# EAGLE design breakout (EAGLE 6.2)
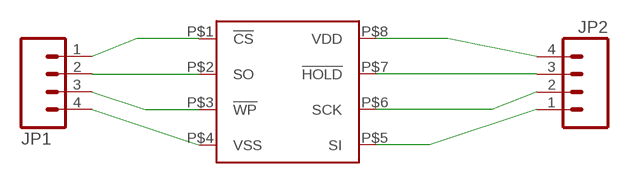
[diagram p0: schematic, sheet 1]

## Parts
JP1  M04PTH  [1X04]
JP2  M04PTH  [1X04]
U$1  MR25H256  [DFN8]

## Nets
N$1: JP1.1 U$1.P$1(!CS)
N$2: JP1.2 U$1.P$2(SO)
N$3: JP1.3 U$1.P$3(!WP)
N$4: JP1.4 U$1.P$4(VSS)
N$5: JP2.1 U$1.P$5(SI)
N$6: JP2.2 U$1.P$6(SCK)
N$7: JP2.3 U$1.P$7(!HOLD)
N$8: JP2.4 U$1.P$8(VDD)

## Library data of the parts
JP1 JP2 = SparkFun-Connectors:M04: Header 4 Standard 4-pin 0.1" header. Use with straight break away headers (SKU : PRT-00116), right angle break away headers (PRT-00553), swiss pins (PRT-00743), machine pins (PRT-00117), and female headers (PRT-00115). Molex polarized connector foot print use with SKU : PRT-08231 with associated crimp pins and housings. 1MM SMD Version SKU: PRT-10208
U$1 = jv2:MR25H256

## Board
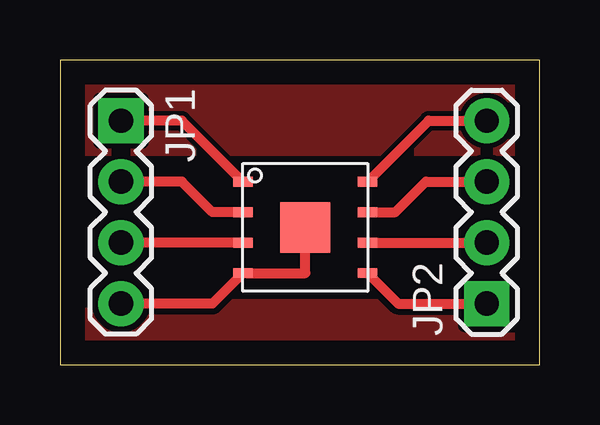
[diagram p1: board, top side]

Size 19.99 x 12.69 mm. Coordinates in mm from the lower left corner, seen from the top.
Outline: 0,0 19.99,0 19.99,12.69 0,12.69 0,0
Copper layers (1*16): Top 0.035mm / dielectric 1.5mm / Bottom 0.035mm
Design rules: minimum track width 10mil, minimum drill 24mil, track to track 8mil, track to pad 8mil, pad to pad 8mil, via to via 8mil, smd to smd 8mil, copper to edge 40mil, drill to drill 8mil, minimum pad ring 10mil, minimum via ring 8mil, stop-mask expansion 4mil, vias tented up to drill 0mil, thermal gap 10mil

### Footprints (pad centres in the part's own frame; a part is rotated, then mirrored left to right if it is on the bottom)
1X04 = drill 1.016 pad 1.88 square: 1 0,0 | drill 1.016 pad 1.88: 2 2.54,0; 3 5.08,0; 4 7.62,0
DFN8 = smd 0.813 x 0.406: P$1 0,3.81; P$2 0,2.54; P$3 0,1.27; P$4 0,0; P$5 5.2,0; P$6 5.2,1.27; P$7 5.2,2.54; P$8 5.2,3.81 | smd 2.1 x 2.1: P$10 2.6,1.9

### Placement (x,y rotation side)
JP1  2.54,10.16 270 top
JP2  17.78,2.54 90 top
U$1  7.62,3.81 0 top

### Tracks (layer width: path | path; a pad name or v marks a point on that pad's centre or on a via)
N$1
  Top 0.406: U$1.P$1 5.08,10.16 JP1.1
N$2
  Top 0.406: U$1.P$2 6.35,6.35 5.08,7.62 JP1.2
N$3
  Top 0.406: U$1.P$3 JP1.3
N$4
  Top 0.406: U$1.P$4 6.35,2.54 JP1.4
N$5
  Top 0.406: U$1.P$5 14.09,2.54 JP2.1
N$6
  Top 0.406: U$1.P$6 JP2.2
N$7
  Top 0.406: U$1.P$7 13.97,6.35 15.24,7.62 JP2.3
N$8
  Top 0.406: U$1.P$8 15.36,10.16 JP2.4
N$9
  pour Top (isolate 0.254): 0,0 0,2.54 20.32,2.54 20.32,0
N$10
  pour Top: 0,12.7 20.32,12.7 20.32,8.89 0,8.89